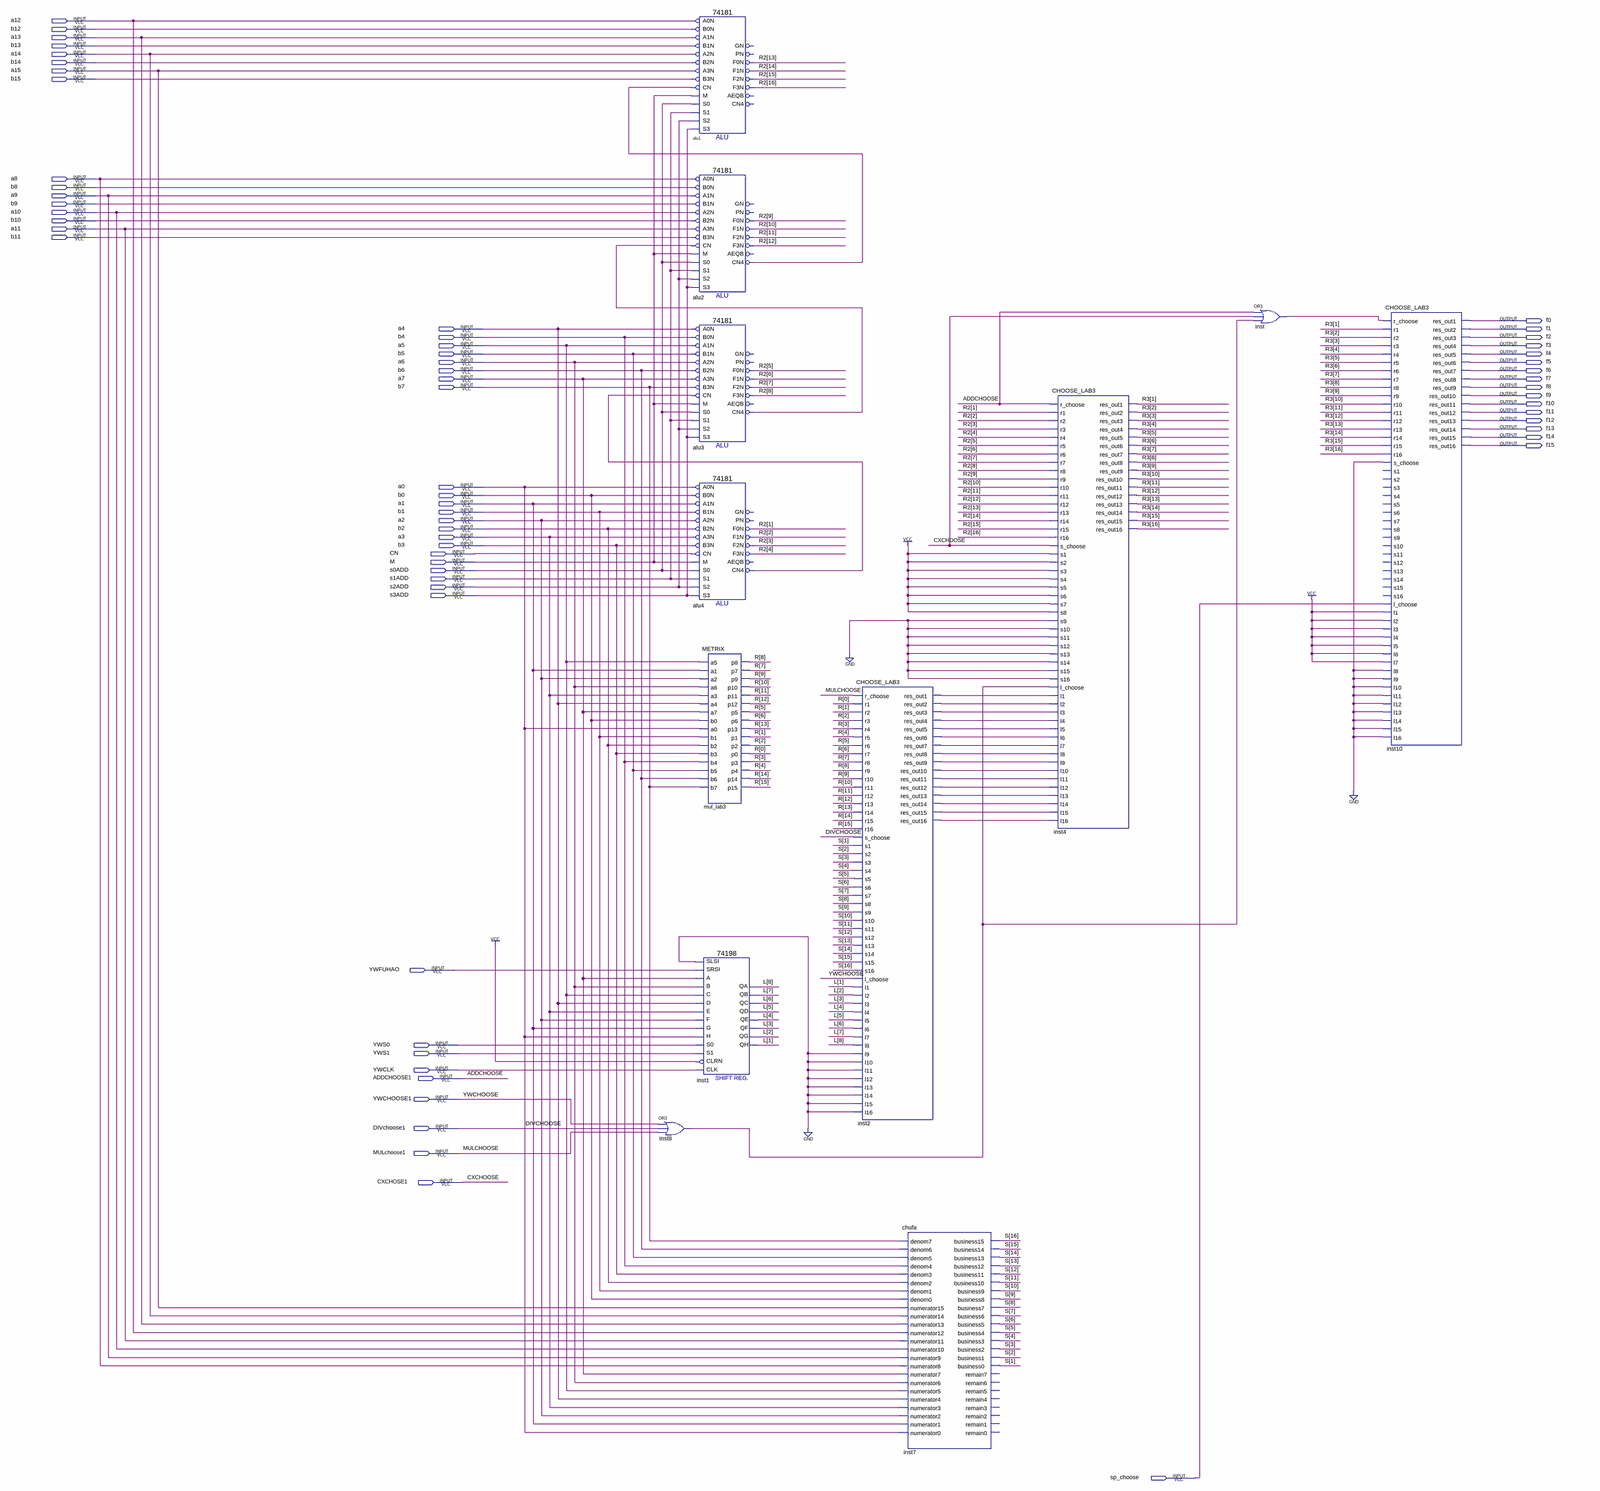
[diagram p0: schematic sheet, whole]
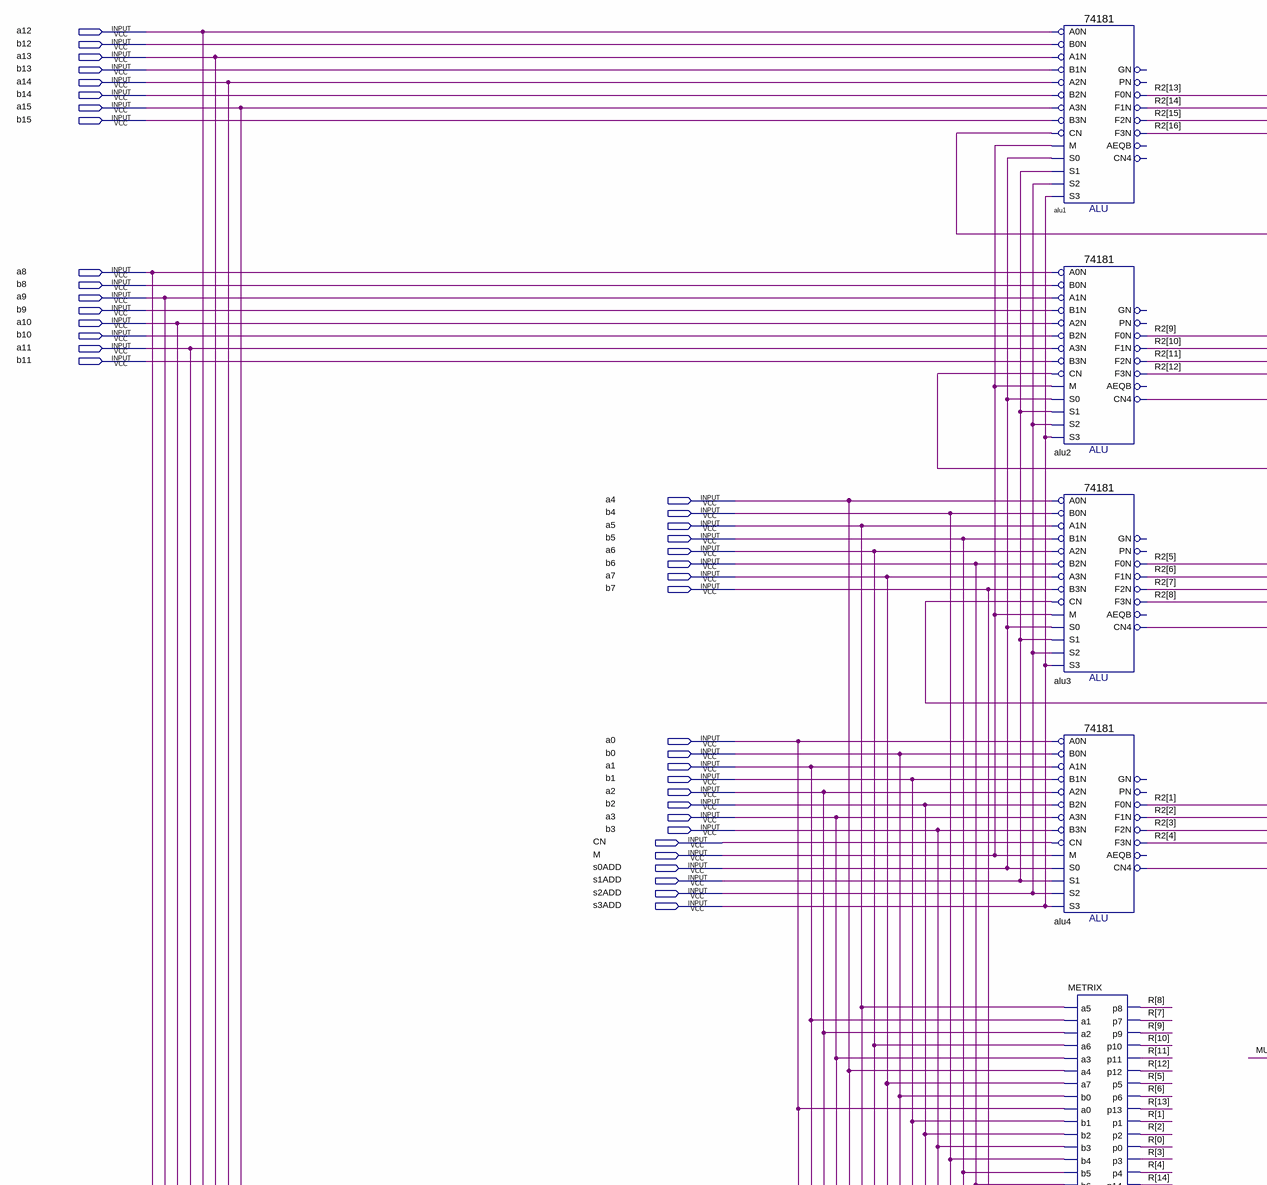
[diagram p1: schematic sheet, upper left part]
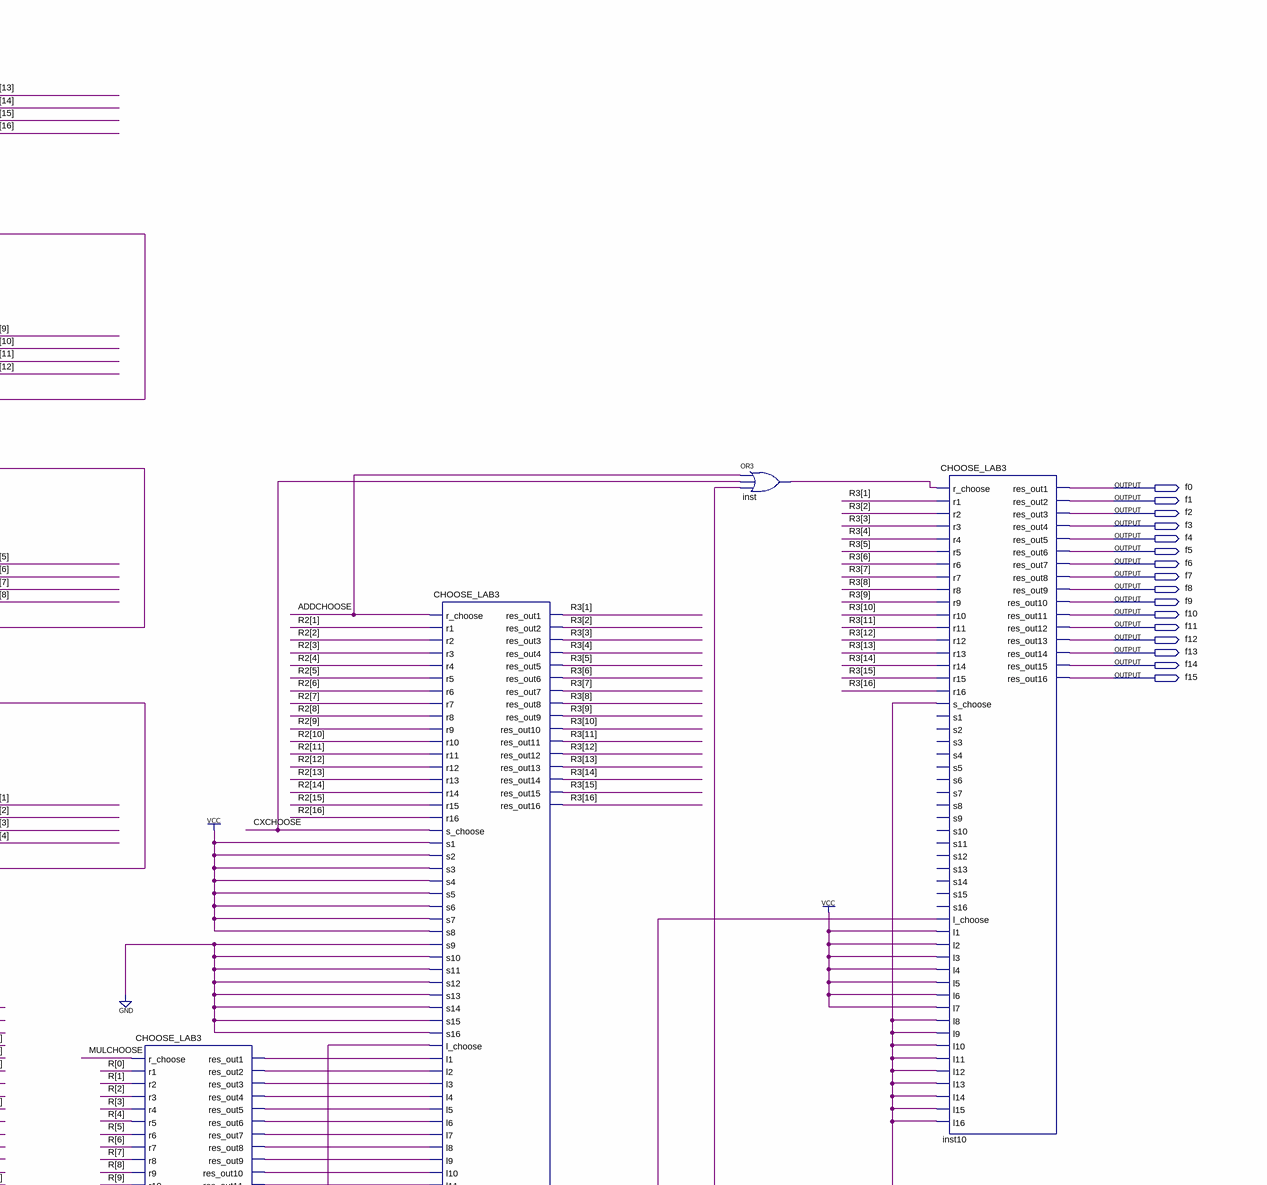
[diagram p2: schematic sheet, upper right part]
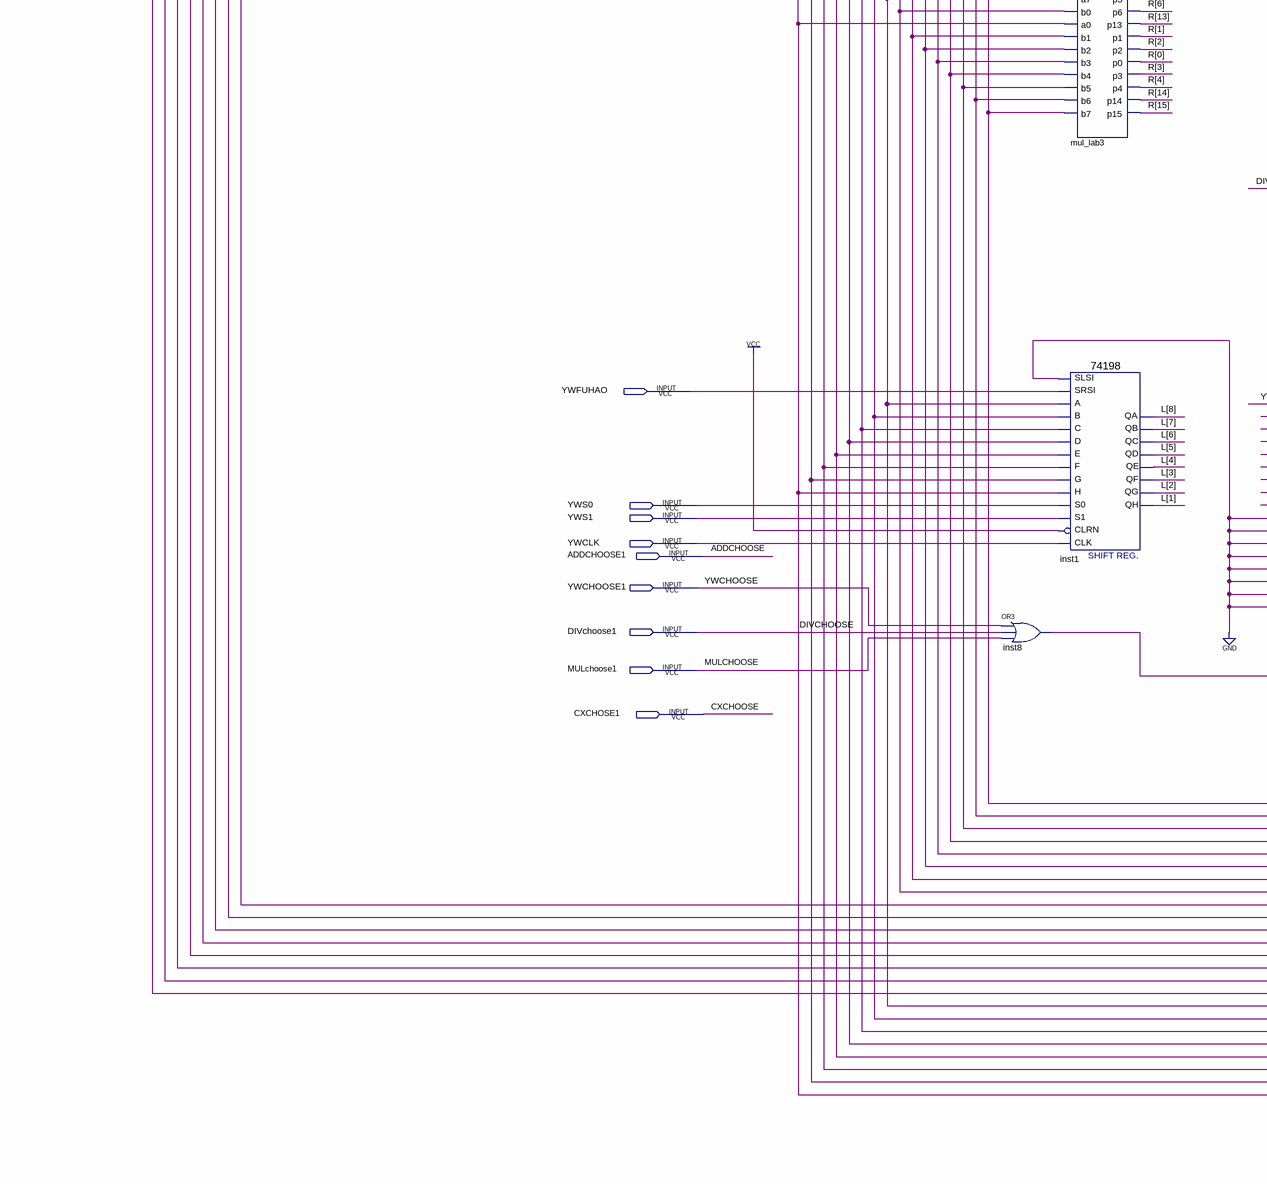
[diagram p3: schematic sheet, lower left part]
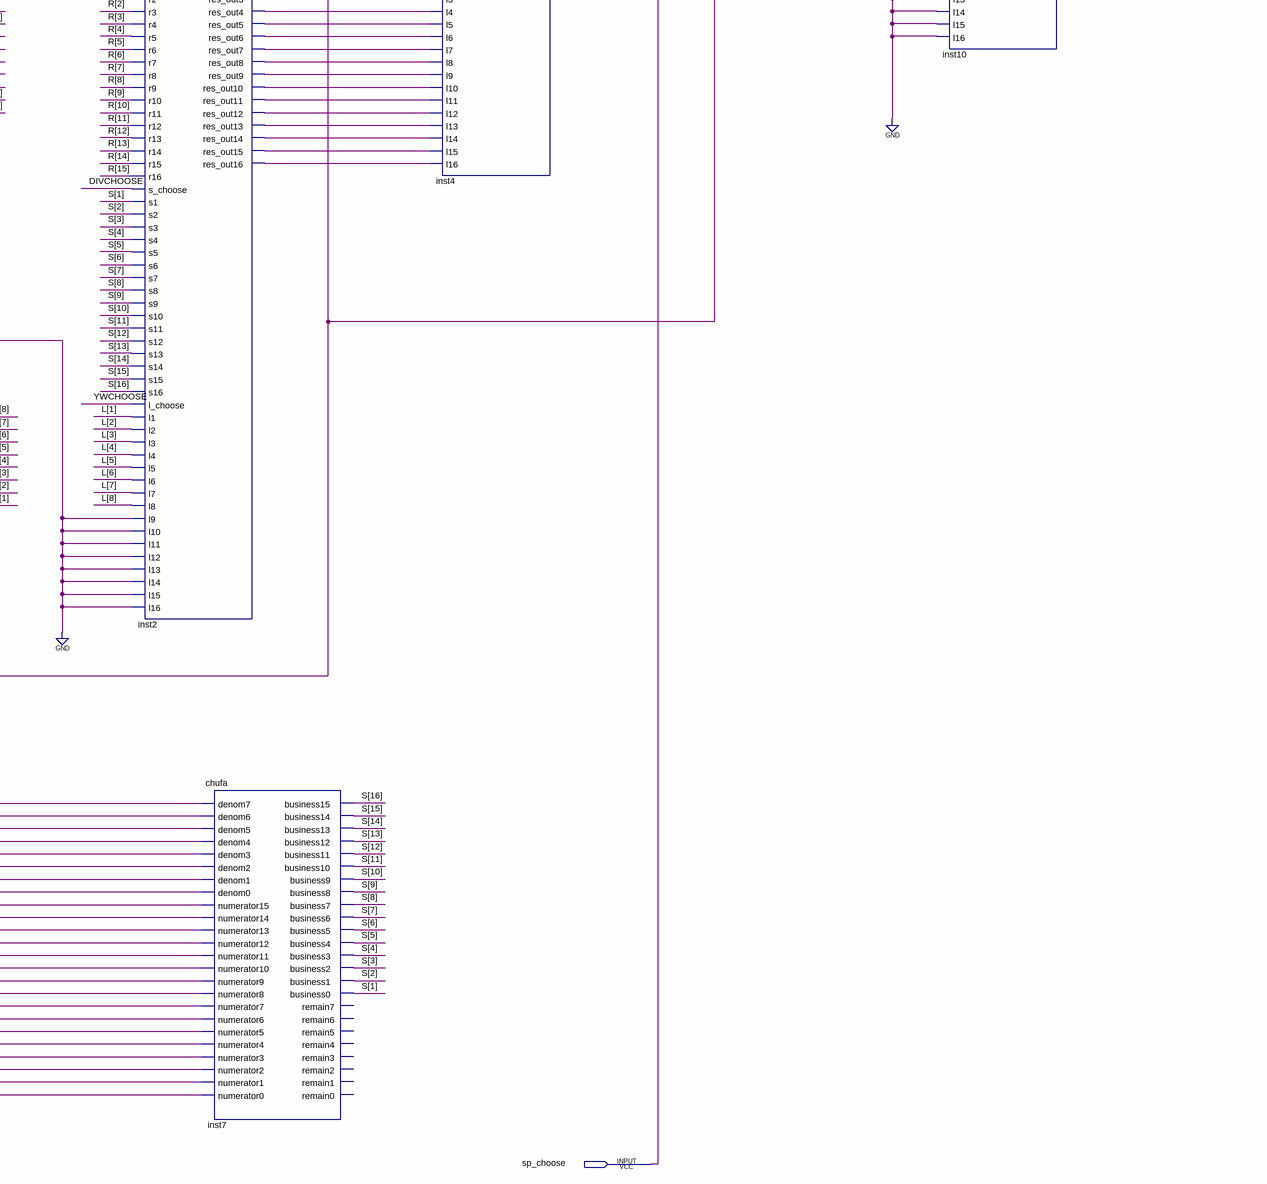
[diagram p4: schematic sheet, lower right part]
// Quartus schematic ALU_LAB3.bdf as structural Verilog: 12 symbols, 64 pins
module ALU_LAB3 (
  input  a12,
  input  b12,
  input  a13,
  input  b13,
  input  a14,
  input  b14,
  input  a15,
  input  b15,
  input  a8,
  input  b8,
  input  a9,
  input  b9,
  input  a10,
  input  b10,
  input  a11,
  input  b11,
  input  a4,
  input  b4,
  input  a5,
  input  b5,
  input  a6,
  input  b6,
  input  a7,
  input  b7,
  input  a0,
  input  b0,
  input  a1,
  input  b1,
  input  a2,
  input  b2,
  input  a3,
  input  b3,
  input  CN,
  input  M,
  input  s0ADD,
  input  s1ADD,
  input  s2ADD,
  input  s3ADD,
  input  YWFUHAO,
  input  YWS0,
  input  YWS1,
  input  YWCLK,
  input  ADDCHOOSE1,
  input  YWCHOOSE1,
  input  DIVchoose1,
  input  MULchoose1,
  input  CXCHOSE1,
  input  sp_choose,
  output f0,
  output f1,
  output f2,
  output f3,
  output f4,
  output f5,
  output f6,
  output f7,
  output f8,
  output f9,
  output f10,
  output f11,
  output f12,
  output f13,
  output f14,
  output f15
);

  wire alu2_cn4, alu3_cn4, alu4_cn4, inst2_res_out1, inst2_res_out2, inst2_res_out3, inst2_res_out4,
       inst2_res_out5, inst2_res_out6, inst2_res_out7, inst2_res_out8, inst2_res_out9, inst2_res_out10,
       inst2_res_out11, inst2_res_out12, inst2_res_out13, inst2_res_out14, inst2_res_out15, inst2_res_out16,
       inst8_out, inst_out;
  wire [8:1] L;
  wire [15:0] R;
  wire [16:1] R2, R3, S;

  or inst8 (inst8_out, YWCHOOSE1, DIVchoose1, MULchoose1);
  \74181  alu1 (
    .B0N(b12), .A0N(a12), .A1N(a13), .B1N(b13), .A3N(a15), .B2N(b14), .A2N(a14), .M(M), .CN(alu2_cn4),
    .B3N(b15), .S2(s2ADD), .S1(s1ADD), .S0(s0ADD), .S3(s3ADD), .F3N(R2[16]), .F1N(R2[14]), .F0N(R2[13]),
    .F2N(R2[15]));  // open: PN, GN, AEQB, CN4
  \74181  alu2 (
    .B0N(b8), .A0N(a8), .A1N(a9), .B1N(b9), .A3N(a11), .B2N(b10), .A2N(a10), .M(M), .CN(alu3_cn4), .B3N(b11),
    .S2(s2ADD), .S1(s1ADD), .S0(s0ADD), .S3(s3ADD), .F3N(R2[12]), .F1N(R2[10]), .F0N(R2[9]), .CN4(alu2_cn4),
    .F2N(R2[11]));  // open: PN, GN, AEQB
  \74181  alu3 (
    .B0N(b4), .A0N(a4), .A1N(a5), .B1N(b5), .A3N(a7), .B2N(b6), .A2N(a6), .M(M), .CN(alu4_cn4), .B3N(b7),
    .S2(s2ADD), .S1(s1ADD), .S0(s0ADD), .S3(s3ADD), .F3N(R2[8]), .F1N(R2[6]), .F0N(R2[5]), .CN4(alu3_cn4),
    .F2N(R2[7]));  // open: PN, GN, AEQB
  \74181  alu4 (
    .B0N(b0), .A0N(a0), .A1N(a1), .B1N(b1), .A3N(a3), .B2N(b2), .A2N(a2), .M(M), .CN(CN), .B3N(b3),
    .S2(s2ADD), .S1(s1ADD), .S0(s0ADD), .S3(s3ADD), .F3N(R2[4]), .F1N(R2[2]), .F0N(R2[1]), .CN4(alu4_cn4),
    .F2N(R2[3]));  // open: PN, GN, AEQB
  METRIX mul_lab3 (
    .a5(a5), .a1(a1), .a2(a2), .a6(a6), .a3(a3), .a4(a4), .a7(a7), .b0(b0), .a0(a0), .b1(b1), .b2(b2),
    .b3(b3), .b4(b4), .b5(b5), .b6(b6), .b7(b7), .p8(R[8]), .p7(R[7]), .p9(R[9]), .p10(R[10]), .p11(R[11]),
    .p12(R[12]), .p5(R[5]), .p6(R[6]), .p13(R[13]), .p1(R[1]), .p2(R[2]), .p0(R[0]), .p3(R[3]), .p4(R[4]),
    .p14(R[14]), .p15(R[15]));
  \74198  inst1 (
    .A(a7), .SRSI(YWFUHAO), .SLSI(1'b0), .E(a3), .S0(YWS0), .B(a6), .C(a5), .D(a4), .H(a0), .G(a1),
    .CLRN(1'b1), .CLK(YWCLK), .F(a2), .S1(YWS1), .QD(L[5]), .QC(L[6]), .QH(L[1]), .QA(L[8]), .QB(L[7]),
    .QE(L[4]), .QF(L[3]), .QG(L[2]));
  CHOOSE_LAB3 inst2 (
    .r_choose(MULchoose1), .r1(R[0]), .r2(R[1]), .r3(R[2]), .r4(R[3]), .r5(R[4]), .r6(R[5]), .r7(R[6]),
    .r8(R[7]), .r9(R[8]), .r10(R[9]), .r11(R[10]), .r12(R[11]), .r13(R[12]), .r14(R[13]), .r15(R[14]),
    .r16(R[15]), .s_choose(DIVchoose1), .s1(S[1]), .s2(S[2]), .s3(S[3]), .s4(S[4]), .s5(S[5]), .s6(S[6]),
    .s7(S[7]), .s8(S[8]), .s9(S[9]), .s10(S[10]), .s11(S[11]), .s12(S[12]), .s13(S[13]), .s14(S[14]),
    .s15(S[15]), .s16(S[16]), .l_choose(YWCHOOSE1), .l1(L[1]), .l2(L[2]), .l3(L[3]), .l4(L[4]), .l5(L[5]),
    .l6(L[6]), .l7(L[7]), .l8(L[8]), .l9(1'b0), .l10(1'b0), .l11(1'b0), .l12(1'b0), .l13(1'b0), .l14(1'b0),
    .l15(1'b0), .l16(1'b0), .res_out1(inst2_res_out1), .res_out2(inst2_res_out2), .res_out3(inst2_res_out3),
    .res_out4(inst2_res_out4), .res_out5(inst2_res_out5), .res_out6(inst2_res_out6),
    .res_out7(inst2_res_out7), .res_out8(inst2_res_out8), .res_out9(inst2_res_out9),
    .res_out10(inst2_res_out10), .res_out11(inst2_res_out11), .res_out12(inst2_res_out12),
    .res_out13(inst2_res_out13), .res_out14(inst2_res_out14), .res_out15(inst2_res_out15),
    .res_out16(inst2_res_out16));
  chufa inst7 (
    .denom7(b7), .denom6(b6), .denom5(b5), .denom4(b4), .denom3(b3), .denom2(b2), .denom1(b1), .denom0(b0),
    .numerator15(a15), .numerator14(a14), .numerator13(a13), .numerator12(a12), .numerator11(a11),
    .numerator10(a10), .numerator9(a9), .numerator8(a8), .numerator7(a7), .numerator6(a6), .numerator5(a5),
    .numerator4(a4), .numerator3(a3), .numerator2(a2), .numerator1(a1), .numerator0(a0), .business15(S[16]),
    .business14(S[15]), .business13(S[14]), .business12(S[13]), .business11(S[12]), .business10(S[11]),
    .business9(S[10]), .business8(S[9]), .business7(S[8]), .business6(S[7]), .business5(S[6]),
    .business4(S[5]), .business3(S[4]), .business2(S[3]), .business1(S[2]), .business0(S[1]));  // open: remain7, remain6, remain5, remain4, remain3, remain2, remain1, remain0
  CHOOSE_LAB3 inst4 (
    .r_choose(ADDCHOOSE1), .r1(R2[1]), .r2(R2[2]), .r3(R2[3]), .r4(R2[4]), .r5(R2[5]), .r6(R2[6]),
    .r7(R2[7]), .r8(R2[8]), .r9(R2[9]), .r10(R2[10]), .r11(R2[11]), .r12(R2[12]), .r13(R2[13]), .r14(R2[14]),
    .r15(R2[15]), .r16(R2[16]), .s_choose(CXCHOSE1), .s1(1'b1), .s2(1'b1), .s3(1'b1), .s4(1'b1), .s5(1'b1),
    .s6(1'b1), .s7(1'b1), .s8(1'b1), .s9(1'b0), .s10(1'b0), .s11(1'b0), .s12(1'b0), .s13(1'b0), .s14(1'b0),
    .s15(1'b0), .s16(1'b0), .l_choose(inst8_out), .l1(inst2_res_out1), .l2(inst2_res_out2),
    .l3(inst2_res_out3), .l4(inst2_res_out4), .l5(inst2_res_out5), .l6(inst2_res_out6), .l7(inst2_res_out7),
    .l8(inst2_res_out8), .l9(inst2_res_out9), .l10(inst2_res_out10), .l11(inst2_res_out11),
    .l12(inst2_res_out12), .l13(inst2_res_out13), .l14(inst2_res_out14), .l15(inst2_res_out15),
    .l16(inst2_res_out16), .res_out1(R3[1]), .res_out2(R3[2]), .res_out3(R3[3]), .res_out4(R3[4]),
    .res_out5(R3[5]), .res_out6(R3[6]), .res_out7(R3[7]), .res_out8(R3[8]), .res_out9(R3[9]),
    .res_out10(R3[10]), .res_out11(R3[11]), .res_out12(R3[12]), .res_out13(R3[13]), .res_out14(R3[14]),
    .res_out15(R3[15]), .res_out16(R3[16]));
  or inst (inst_out, ADDCHOOSE1, CXCHOSE1, inst8_out);
  CHOOSE_LAB3 inst10 (
    .r_choose(inst_out), .r1(R3[1]), .r2(R3[2]), .r3(R3[3]), .r4(R3[4]), .r5(R3[5]), .r6(R3[6]), .r7(R3[7]),
    .r8(R3[8]), .r9(R3[9]), .r10(R3[10]), .r11(R3[11]), .r12(R3[12]), .r13(R3[13]), .r14(R3[14]),
    .r15(R3[15]), .r16(R3[16]), .s_choose(1'b0), .l_choose(sp_choose), .l1(1'b1), .l2(1'b1), .l3(1'b1),
    .l4(1'b1), .l5(1'b1), .l6(1'b1), .l7(1'b1), .l8(1'b0), .l9(1'b0), .l10(1'b0), .l11(1'b0), .l12(1'b0),
    .l13(1'b0), .l14(1'b0), .l15(1'b0), .l16(1'b0), .res_out1(f0), .res_out2(f1), .res_out3(f2),
    .res_out4(f3), .res_out5(f4), .res_out6(f5), .res_out7(f6), .res_out8(f7), .res_out9(f8), .res_out10(f9),
    .res_out11(f10), .res_out12(f11), .res_out13(f12), .res_out14(f13), .res_out15(f14), .res_out16(f15));  // open: s1, s2, s3, s4, s5, s6, s7, s8, s9, s10, s11, s12, s13, s14, s15, s16

  // Other names for the same wires on the sheet: ADDCHOOSE = ADDCHOOSE1; CXCHOOSE = CXCHOSE1; DIVCHOOSE = DIVchoose1;
  //   MULCHOOSE = MULchoose1; YWCHOOSE = YWCHOOSE1
endmodule
